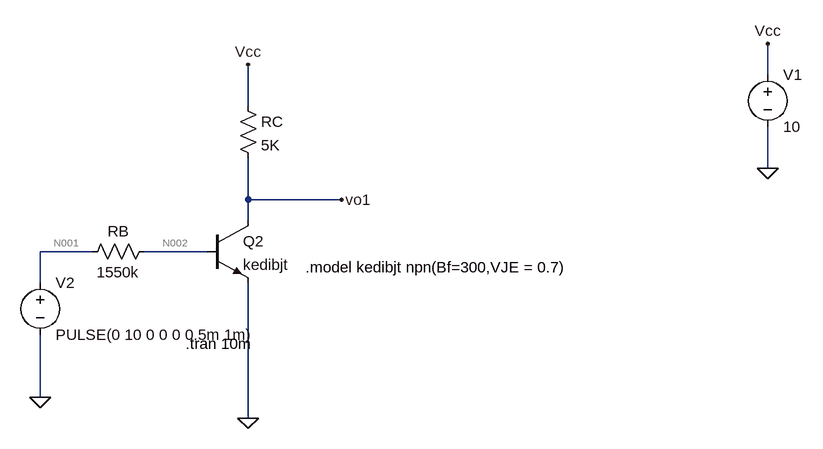
[diagram p0: schematic Draft4.asc]
Draft4.asc, the LTspice schematic file:
Version 4
SHEET 1 880 680
WIRE 288 0 288 -48
WIRE -512 48 -512 -16
WIRE 288 144 288 80
WIRE -512 192 -512 128
WIRE -368 192 -512 192
WIRE -512 224 -512 192
WIRE -752 272 -832 272
WIRE -576 272 -672 272
WIRE -832 320 -832 272
WIRE -832 496 -832 400
WIRE -512 528 -512 320
FLAG -368 192 vo1
FLAG -512 -16 Vcc
FLAG 288 -48 Vcc
FLAG 288 144 0
FLAG -832 496 0
FLAG -512 528 0
SYMBOL npn -576 224 R0
SYMATTR InstName Q2
SYMATTR Value kedibjt
SYMBOL res -528 32 R0
SYMATTR InstName RC
SYMATTR Value 5K
SYMBOL voltage 288 -16 R0
WINDOW 123 0 0 Left 0
WINDOW 39 0 0 Left 0
SYMATTR InstName V1
SYMATTR Value 10
SYMBOL res -656 256 R90
WINDOW 0 0 56 VBottom 2
WINDOW 3 32 56 VTop 2
SYMATTR InstName RB
SYMATTR Value 1550k
SYMBOL voltage -832 304 R0
WINDOW 123 0 0 Left 0
WINDOW 39 0 0 Left 0
SYMATTR InstName V2
SYMATTR Value PULSE(0 10 0 0 0 0.5m 1m)
TEXT -424 296 Left 2 !.model kedibjt npn(Bf=300,VJE = 0.7)
TEXT -608 414 Left 2 !.tran 10m

The netlist it stands for:
* Draft4.asc
Q2 vo1 N002 0 0 kedibjt
RC Vcc vo1 5K
V1 Vcc 0 10
RB N002 N001 1550k
V2 N001 0 PULSE(0 10 0 0 0 0.5m 1m)
.model NPN NPN
.model PNP PNP
.lib standard.bjt
.model kedibjt npn(Bf=300,VJE = 0.7)
.tran 10m
.backanno
.end

* Results of the author's LTspice run, read from the files saved beside the schematic
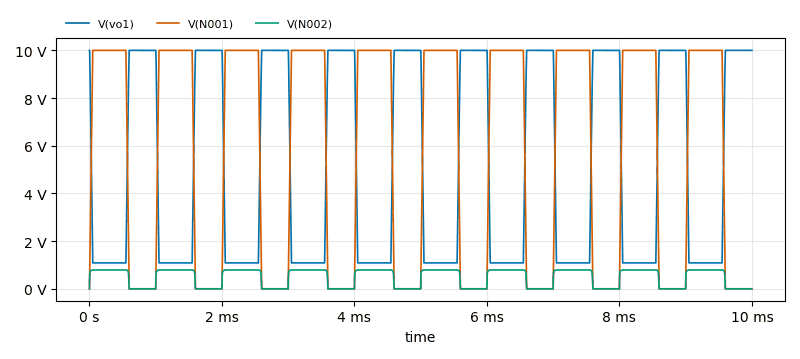
[diagram p1: Transient Analysis of Draft4.asc, plotted from the saved traces]
* Transient Analysis, 1 run:
*   V(vo1): min 1.086 V, max 10 V, average 5.127 V, rms 6.695 V, last 10 V
*   V(N001): min 0 V, max 10 V, average 5.5 V, rms 7.311 V, last 0 V
*   V(N002): min 15.5 µV, max 789.3 mV, average 464.2 mV, rms 602.8 mV, last 15.5 µV